# EAGLE schematic SwitchV1 (EAGLE 9.4.2)
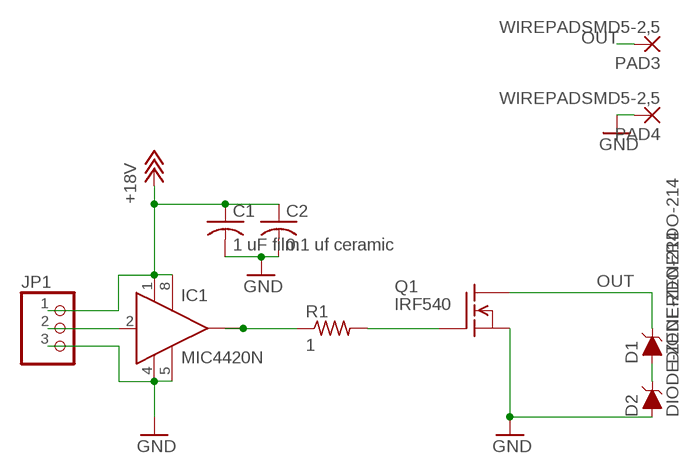
[diagram p0: schematic, sheet 1]

## Parts
C1  1 uF film  C-US050-045X075  [C050-045X075]
C2  0.1 uf ceramic  C-US025-030X050  [C025-030X050]
D1  DIODE-ZENERDO-214  [SMA-DIODE]
D2  DIODE-ZENERDO-214  [SMA-DIODE]
IC1  MIC4420N  [DIL08]
JP1  PINHD-1X3  [1X03]
PAD3  WIREPADSMD5-2,5  [5-2,5]
PAD4  WIREPADSMD5-2,5  [5-2,5]
Q1  IRF540  [TO220]
R1  1  R-US_0207/7  [0207/7]

## Nets
+18V: C1.1 C2.1 IC1.1(VS) IC1.8(VS1) JP1.1
GND: C1.2 C2.2 D2.A IC1.4(GND) IC1.5(GND1) JP1.3 PAD4.1(P) Q1.3(S)
N$1: IC1.6(OUT) IC1.7(OUT) R1.1
N$2: Q1.1(G) R1.2
N$3: D1.A D2.C
N$4: IC1.2(IN) JP1.2
OUT: D1.C PAD3.1(P) Q1.2(D)

## Library data of the parts
C1 C2 = rcl:C-US: CAPACITOR, American symbol; SPICEPREFIX: C
D1 D2 = sparkfun-discretesemi:DIODE-ZENER: Zener Diode A Zener diode allows current to flow from its anode to its cathode like a normal semiconductor diode, but it also permits current to flow in the reverse direction when its "Zener voltage" is reached. - WIkipedia
IC1 = transistor-power:MIC4420: 6A-Peak Low-Side MOSFET Driver Bipolar/CMOS/DMOS Process http://www.micrel.com/_PDF/mic4420.pdf
JP1 = pinhead:PINHD-1X3: PIN HEADER
PAD3 PAD4 = wirepad:WIREPAD: Wire PAD connect wire on PCB
Q1 = transistor-fet:IRF540: N-Channel Enhancement MOSFET (HEXFET); 100V; 28A; 0,077Ohm
R1 = rcl:R-US_: RESISTOR, American symbol; SPICEPREFIX: R